# Altium schematic sheet PedalBoard.SchDoc
size D; SheetNumber: 1; SheetTotal: 1; SPICEModelCacheDNIRTYNY: <root> / <DocumentId>DNIRTYNY</DocumentId> / </root>
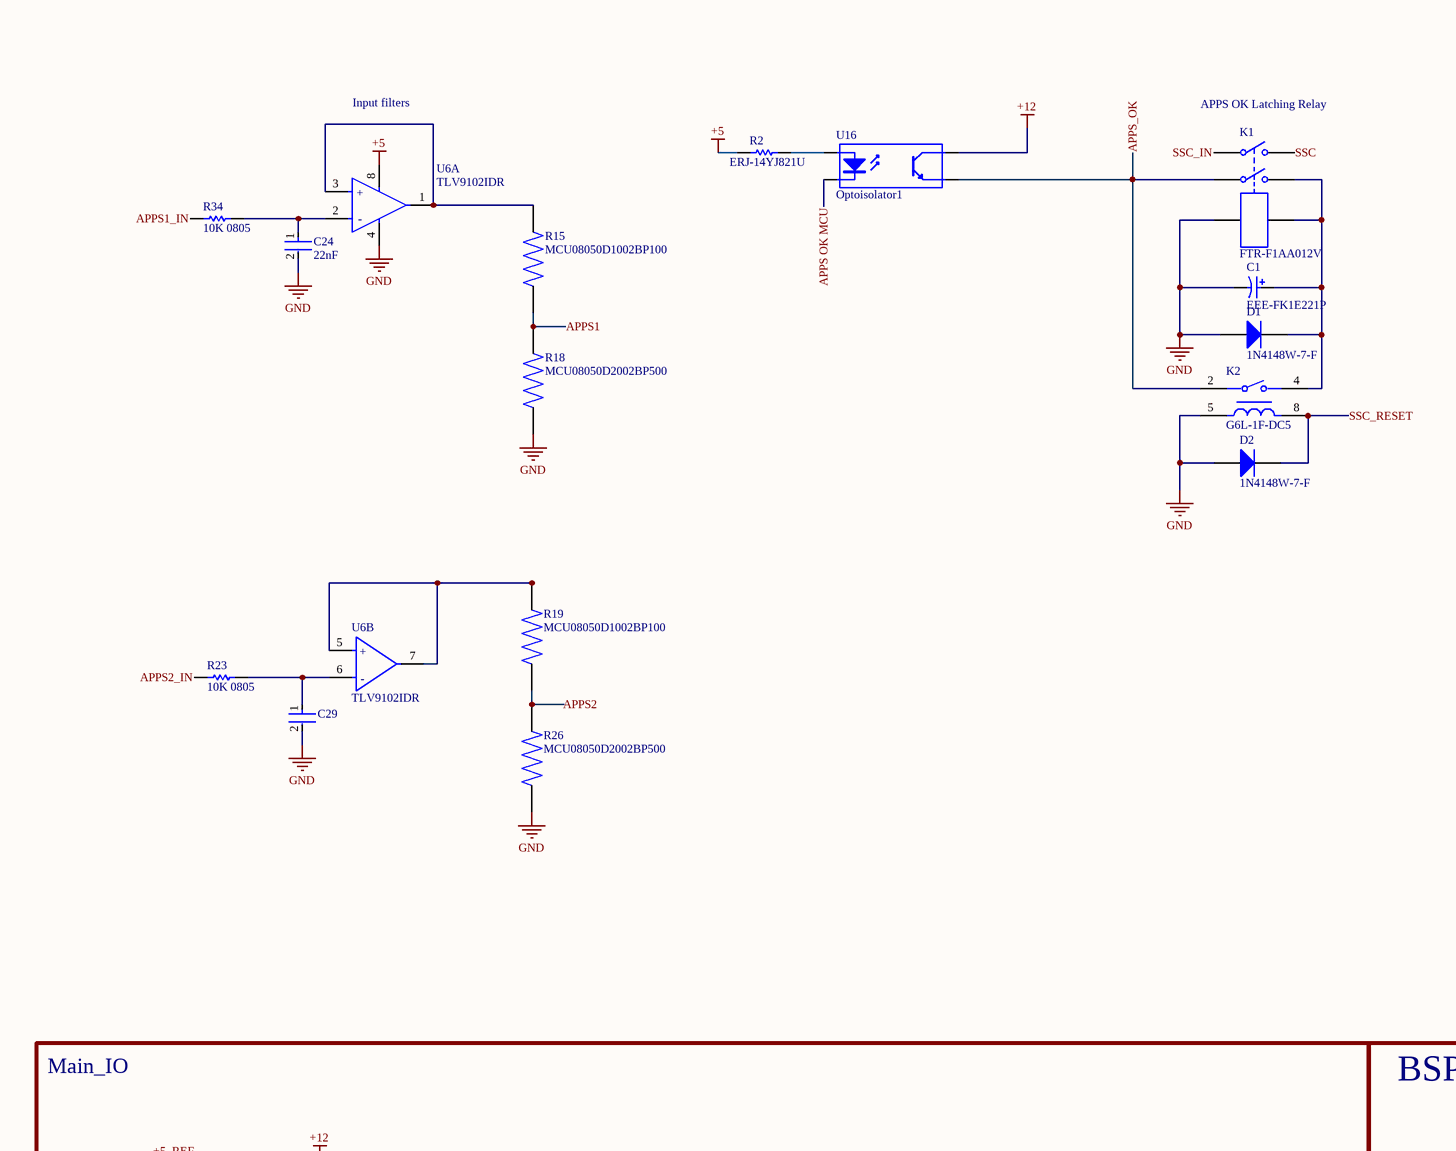
[diagram p0: PedalBoard.SchDoc, top left]
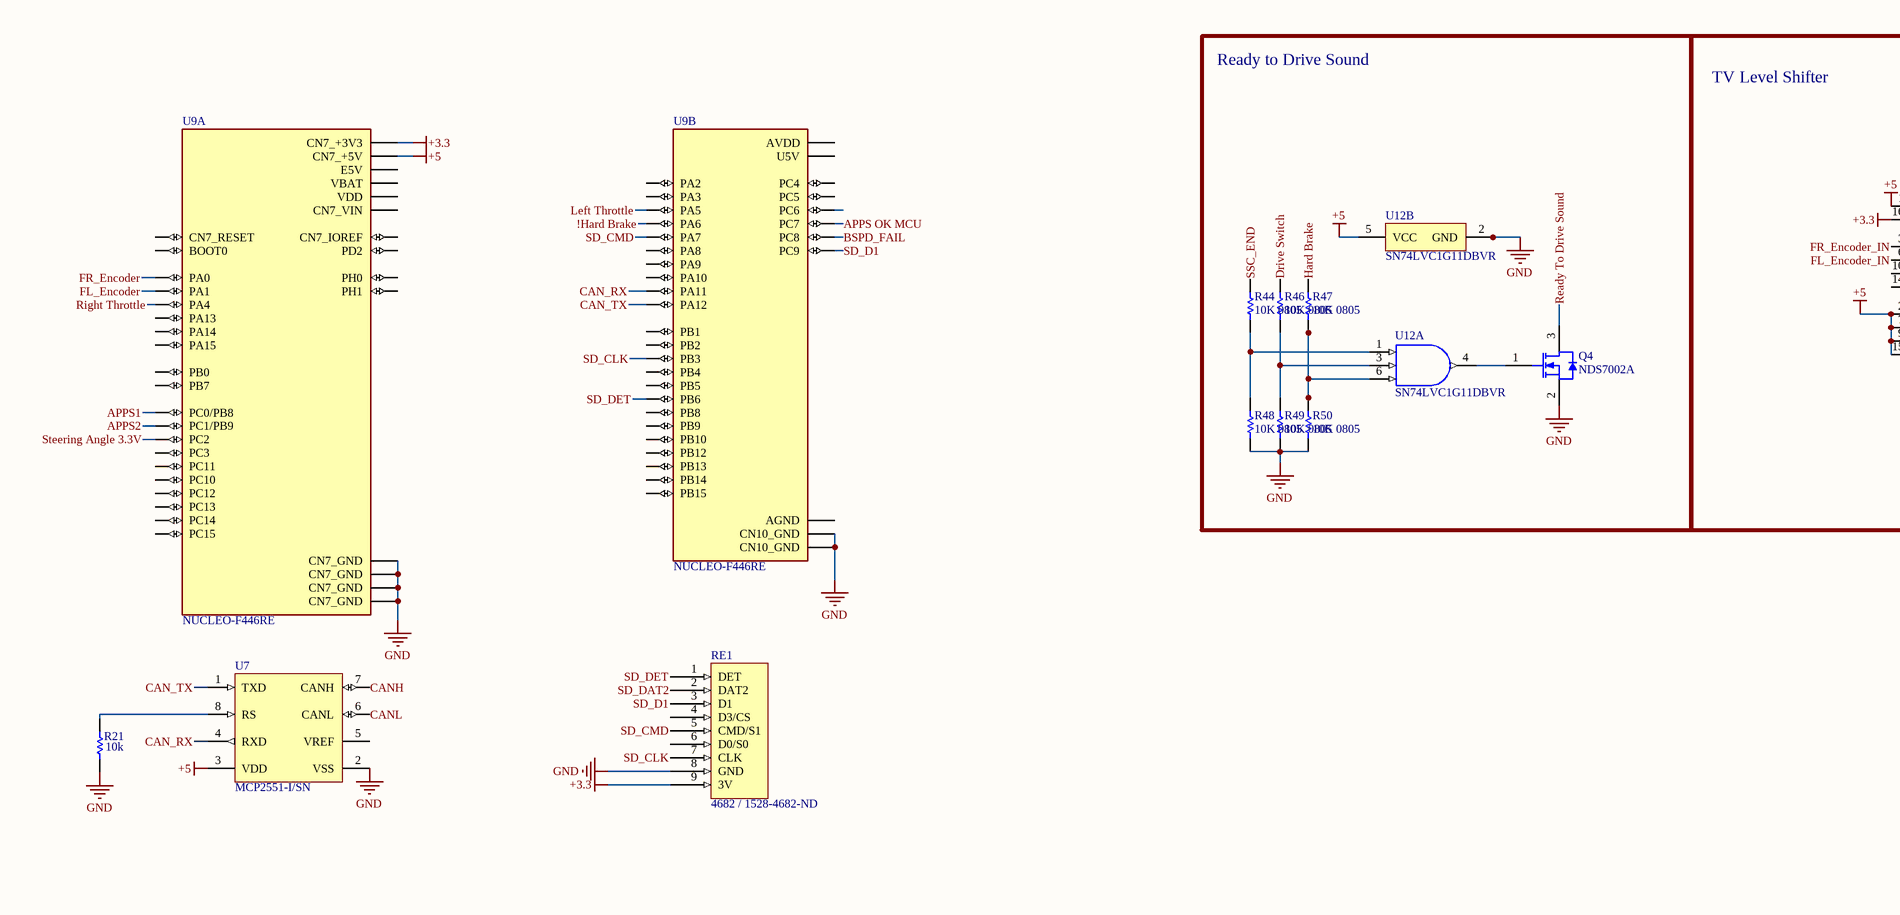
[diagram p1: PedalBoard.SchDoc, top middle]
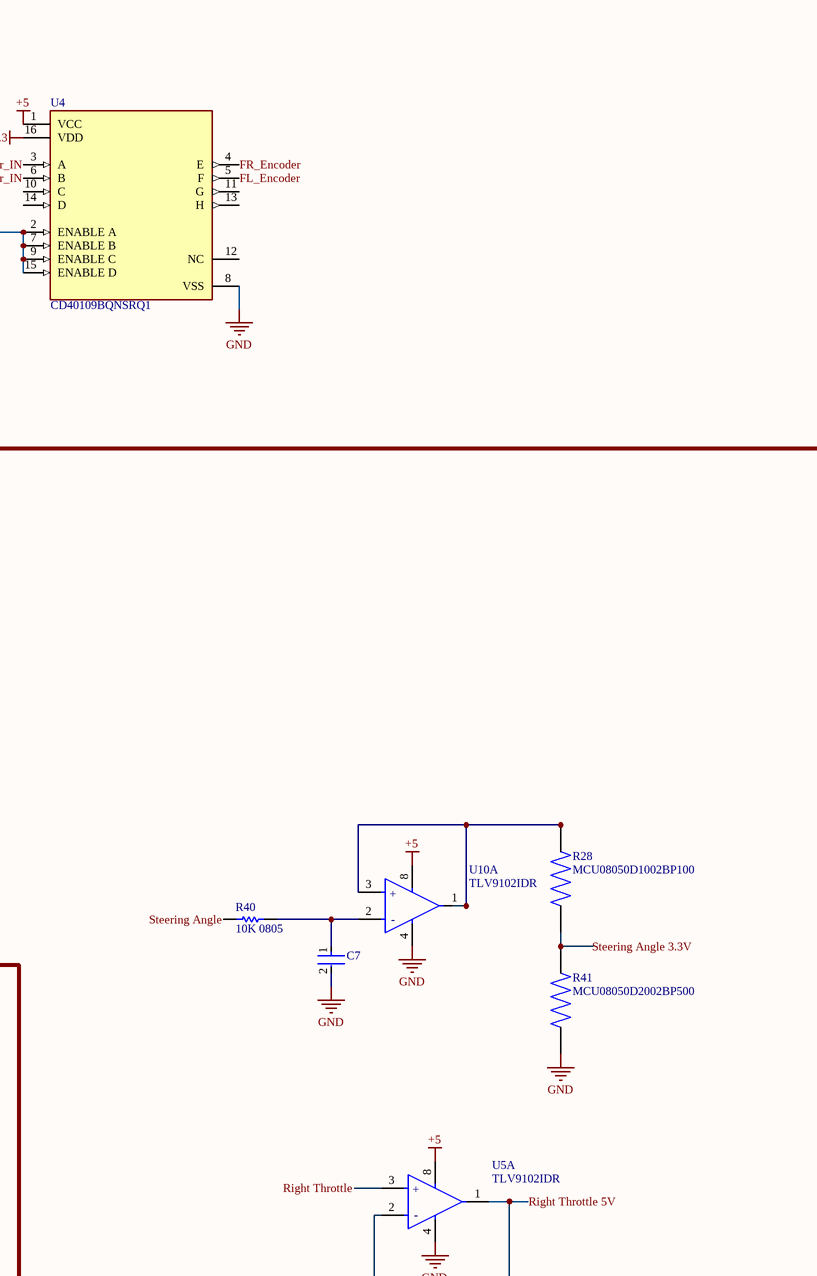
[diagram p2: PedalBoard.SchDoc, top right]
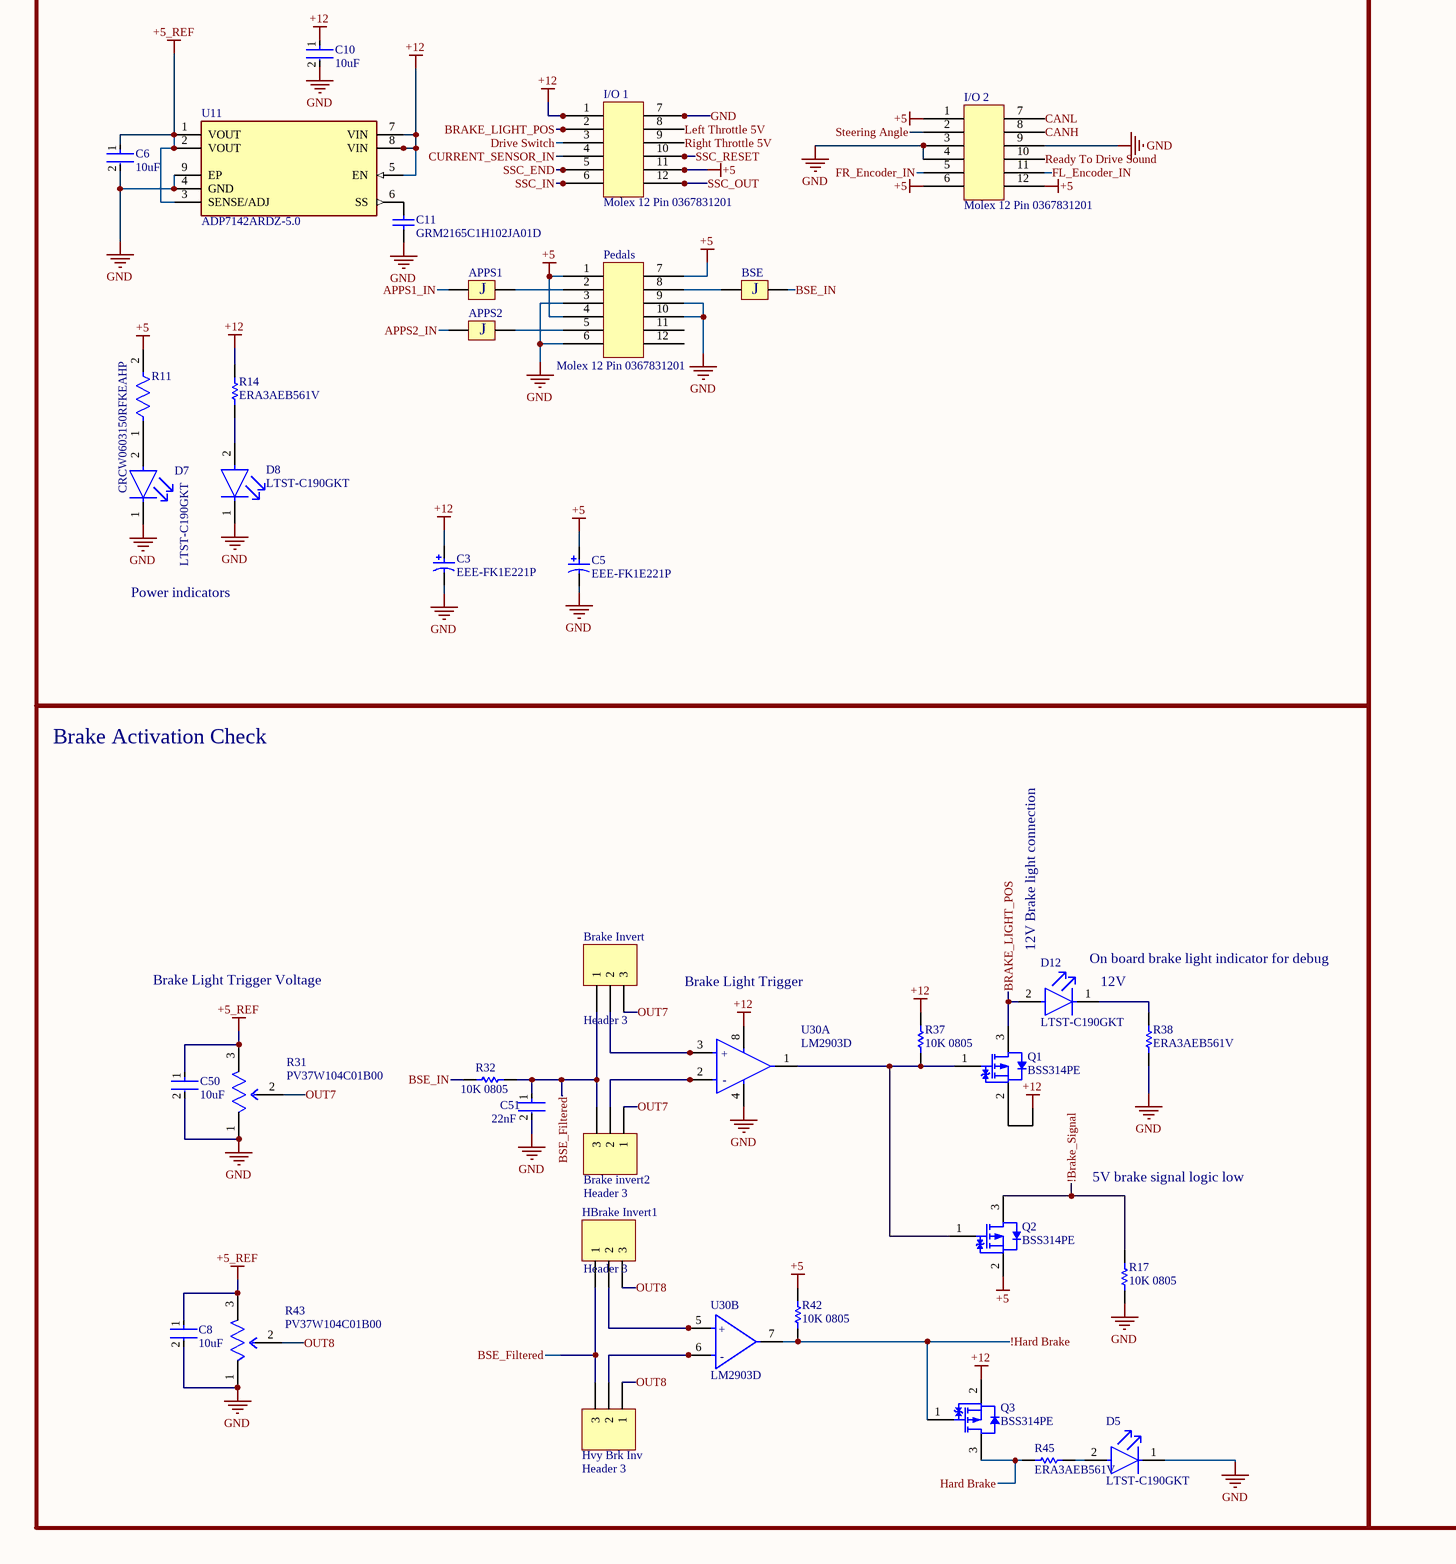
[diagram p3: PedalBoard.SchDoc, bottom left]
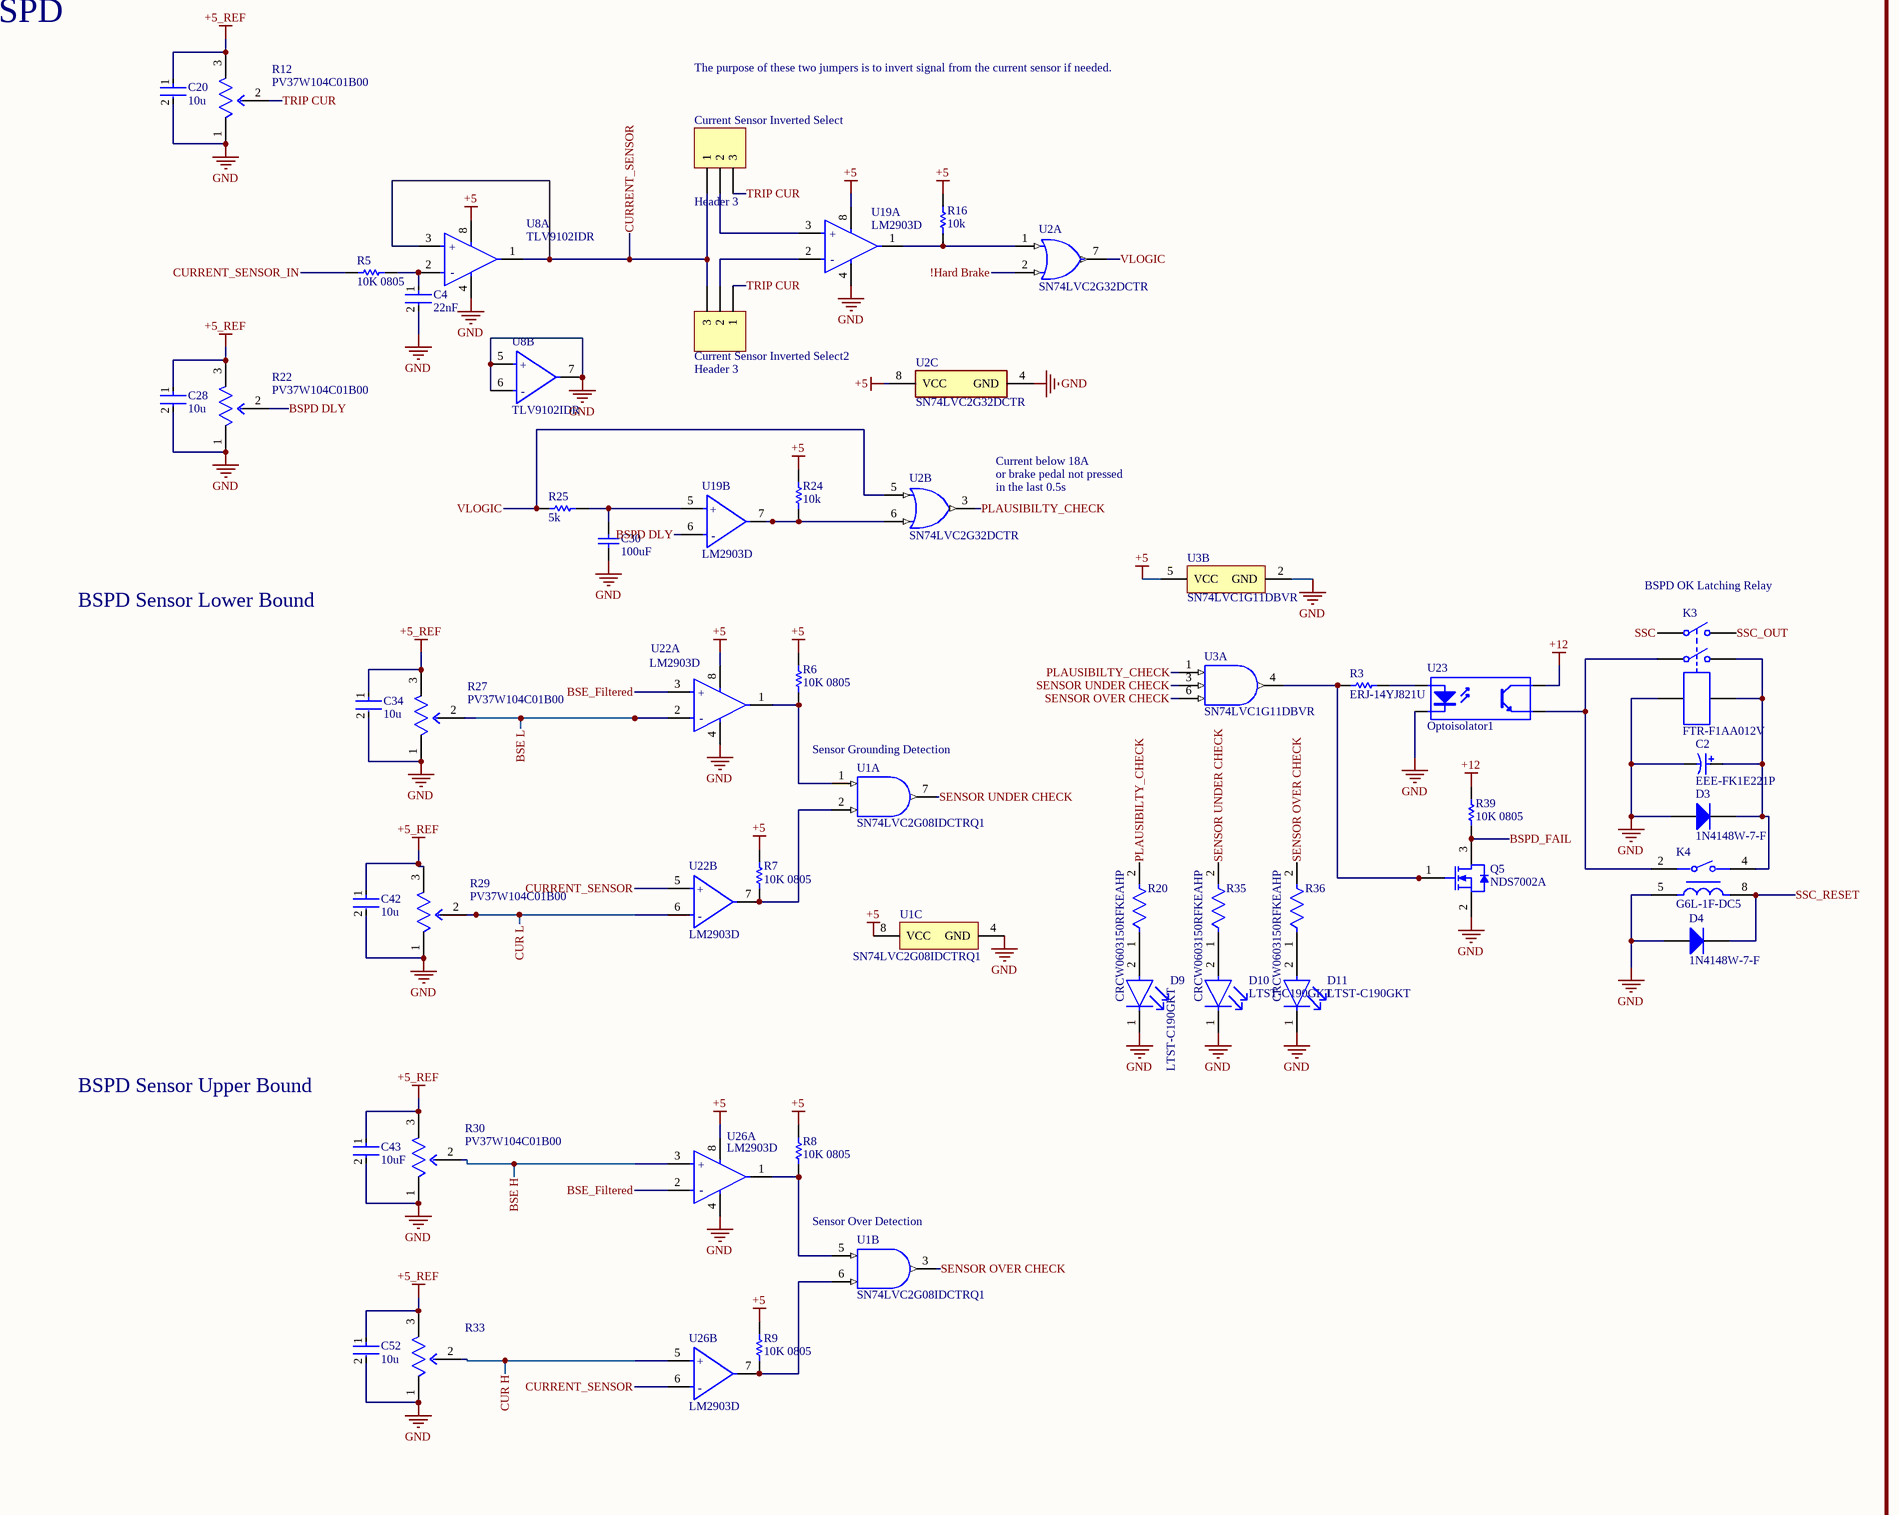
[diagram p4: PedalBoard.SchDoc, bottom middle]
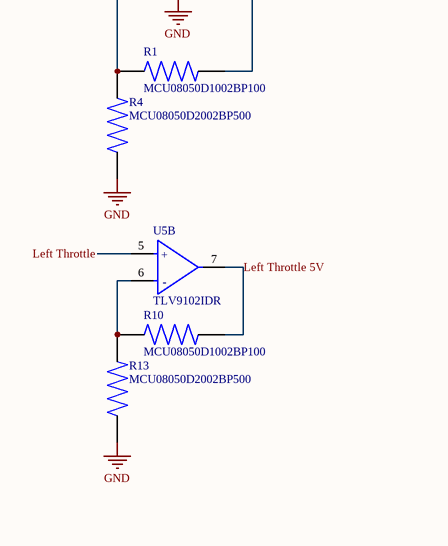
[diagram p5: PedalBoard.SchDoc, bottom right]

## Parts
APPS1  Jumper Connector  [Jumper Connector]  (value not drawn)
APPS2  Jumper Connector  [Jumper Connector]  (value not drawn)
Brake_Invert  Header 3  [HDR1X3]
Brake_invert2  Header 3  [HDR1X3]
BSE  Jumper Connector  [Jumper Connector]  (value not drawn)
C1  EEE-FK1E221P  [PNSC-EEE-FK1E221P_N]
C2  EEE-FK1E221P  [PNSC-EEE-FK1E221P_N]
C3  EEE-FK1E221P  [PNSC-EEE-FK1E221P_N]
C4  22nF  [FP-C0805C-DN-MFG]
C5  EEE-FK1E221P  [PNSC-EEE-FK1E221P_N]
C6  10uF  [FP-C0603C106M9PACTU-MFG]
C7  C0805C223K5RACTU  [FP-C0805C-DN-MFG]  (value not drawn)
C8  10uF  [FP-C0603C106M9PACTU-MFG]
C10  10uF  [FP-C0603C106M9PACTU-MFG]
C11  GRM2165C1H102JA01D  [CAPC2013X70X45NL10T25]
C20  10u  [FP-C0603C106M9PACTU-MFG]
C24  22nF  [FP-C0805C-DN-MFG]
C28  10u  [FP-C0603C106M9PACTU-MFG]
C29  C0805C223K5RACTU  [FP-C0805C-DN-MFG]  (value not drawn)
C30  100uF  [CAPC1608X90X35LL15T15]
C34  10u  [FP-C0603C106M9PACTU-MFG]
C42  10u  [FP-C0603C106M9PACTU-MFG]
C43  10uF  [FP-C0603C106M9PACTU-MFG]
C50  10uF  [FP-C0603C106M9PACTU-MFG]
C51  22nF  [FP-C0805C-DN-MFG]
C52  10u  [FP-C0603C106M9PACTU-MFG]
Current_Sensor_Inverted_Select  Header 3  [HDR1X3]
Current_Sensor_Inverted_Select2  Header 3  [HDR1X3]
D1  1N4148W-7-F  [DIOD-SOD123-2_V]
D2  1N4148W-7-F  [DIOD-SOD123-2_V]
D3  1N4148W-7-F  [DIOD-SOD123-2_V]
D4  1N4148W-7-F  [DIOD-SOD123-2_V]
D5  LTST-C190GKT  [FP-LTST-C190GKT-MFG]
D7  LTST-C190GKT  [FP-LTST-C190GKT-MFG]
D8  LTST-C190GKT  [FP-LTST-C190GKT-MFG]
D9  LTST-C190GKT  [FP-LTST-C190GKT-MFG]
D10  LTST-C190GKT  [FP-LTST-C190GKT-MFG]
D11  LTST-C190GKT  [FP-LTST-C190GKT-MFG]
D12  LTST-C190GKT  [FP-LTST-C190GKT-MFG]
HBrake_Invert1  Header 3  [HDR1X3]
Hvy_Brk_Inv  Header 3  [HDR1X3]
I/O_1  Molex 12 Pin 0367831201  [Molex 12 pos 0367831201 - duplicate]
I/O_2  Molex 12 Pin 0367831201  [Molex 12 pos 0367831201 - duplicate]
K1  FTR-F1AA012V  [FTR-F1AA012V]
K2  G6L-1F-DC5  [FP-G6L-1F-DC5-MFG]
K3  FTR-F1AA012V  [FTR-F1AA012V]
K4  G6L-1F-DC5  [FP-G6L-1F-DC5-MFG]
Pedals  Molex 12 Pin 0367831201  [Molex 12 pos 0367831201 - duplicate]
Q1  BSS314PE  [INF-PG-SOT23_N]
Q2  BSS314PE  [INF-PG-SOT23_N]
Q3  BSS314PE  [INF-PG-SOT23_N]
Q4  NDS7002A  [FAIR-SOT23-3_V]
Q5  NDS7002A  [FAIR-SOT23-3_V]
R1  MCU08050D1002BP100  [RESC2012X55N]
R2  ERJ-14YJ821U  [RESC3225X70X50LL20T20]
R3  ERJ-14YJ821U  [RESC3225X70X50LL20T20]
R4  MCU08050D2002BP500  [RESC2012X55N]
R5  10K 0805  [RESC2013X60X35NL10T20]
R6  10K 0805  [RESC2013X60X35NL10T20]
R7  10K 0805  [RESC2013X60X35NL10T20]
R8  10K 0805  [RESC2013X60X35NL10T20]
R9  10K 0805  [RESC2013X60X35NL10T20]
R10  MCU08050D1002BP100  [RESC2012X55N]
R11  CRCW0603150RFKEAHP  [FP-CRCW0603-HPe3-MFG]
R12  PV37W104C01B00  [FP-PV37W104C01B00-MFG]
R13  MCU08050D2002BP500  [RESC2012X55N]
R14  ERA3AEB561V  [RESC1608X55X30LL20T20]
R15  MCU08050D1002BP100  [RESC2012X55N]
R16  10k  [RESC1609X55X30LL15T15]
R17  10K 0805  [RESC2013X60X35NL10T20]
R18  MCU08050D2002BP500  [RESC2012X55N]
R19  MCU08050D1002BP100  [RESC2012X55N]
R20  CRCW0603150RFKEAHP  [FP-CRCW0603-HPe3-MFG]
R21  10k  [RESC1609X55X30LL15T15]
R22  PV37W104C01B00  [FP-PV37W104C01B00-MFG]
R23  10K 0805  [RESC2013X60X35NL10T20]
R24  10k  [RESC1609X55X30LL15T15]
R25  5k  [RESC1609X55X30LL15T15]
R26  MCU08050D2002BP500  [RESC2012X55N]
R27  PV37W104C01B00  [FP-PV37W104C01B00-MFG]
R28  MCU08050D1002BP100  [RESC2012X55N]
R29  PV37W104C01B00  [FP-PV37W104C01B00-MFG]
R30  PV37W104C01B00  [FP-PV37W104C01B00-MFG]
R31  PV37W104C01B00  [FP-PV37W104C01B00-MFG]
R32  10K 0805  [RESC2013X60X35NL10T20]
R33  PV37W104C01B00  [FP-PV37W104C01B00-MFG]  (value not drawn)
R34  10K 0805  [RESC2013X60X35NL10T20]
R35  CRCW0603150RFKEAHP  [FP-CRCW0603-HPe3-MFG]
R36  CRCW0603150RFKEAHP  [FP-CRCW0603-HPe3-MFG]
R37  10K 0805  [RESC2013X60X35NL10T20]
R38  ERA3AEB561V  [RESC1608X55X30LL20T20]
R39  10K 0805  [RESC2013X60X35NL10T20]
R40  10K 0805  [RESC2013X60X35NL10T20]
R41  MCU08050D2002BP500  [RESC2012X55N]
R42  10K 0805  [RESC2013X60X35NL10T20]
R43  PV37W104C01B00  [FP-PV37W104C01B00-MFG]
R44  10K 0805  [RESC2013X60X35NL10T20]
R45  ERA3AEB561V  [RESC1608X55X30LL20T20]
R46  10K 0805  [RESC2013X60X35NL10T20]
R47  10K 0805  [RESC2013X60X35NL10T20]
R48  10K 0805  [RESC2013X60X35NL10T20]
R49  10K 0805  [RESC2013X60X35NL10T20]
R50  10K 0805  [RESC2013X60X35NL10T20]
RE1  4682 / 1528-4682-ND  [SDCARD]
U1  SN74LVC2G08IDCTRQ1  [DCT0008A_N]  (parts A,B,C of 3)
U2  SN74LVC2G32DCTR  [FP-DCT0008A-MFG]  (parts A,B,C of 3)
U3  SN74LVC1G11DBVR  [DBV0006A_N]  (parts A,B of 2)
U4  CD40109BQNSRQ1  [FP-NS0016A-IPC_C]
U5  TLV9102IDR  [FP-D0008A-IPC_B]  (parts A,B of 2)
U6  TLV9102IDR  [FP-D0008A-IPC_B]  (parts A,B of 2)
U7  MCP2551-I/SN  [MCHP-SN8_V]
U8  TLV9102IDR  [FP-D0008A-IPC_B]  (parts A,B of 2)
U9  NUCLEO-F446RE  [MODULE_NUCLEO-F446RE]  (parts A,B of 6)
U10  TLV9102IDR  [FP-D0008A-IPC_B]  (part A of 2)
U11  ADP7142ARDZ-5.0  [FP-RD-8-1-IPC_B]
U12  SN74LVC1G11DBVR  [DBV0006A_N]  (parts A,B of 2)
U16  Optoisolator1  [FOD852]
U19  LM2903D  [FP-SO8-IPC_C]  (parts A,B of 2)
U22  LM2903D  [FP-SO8-IPC_C]  (parts A,B of 2)
U23  Optoisolator1  [FOD852]
U26  LM2903D  [FP-SO8-IPC_C]  (parts A,B of 2)
U30  LM2903D  [FP-SO8-IPC_C]  (parts A,B of 2)

## Blocks framed on the sheet
Ready to Drive Sound: Q4 R44 R46-R50 U12
TV Level Shifter: U4
Main_IO: APPS1 APPS2 BSE C3 C5 C6 C10 C11 D7 D8 I/O_1 I/O_2 Pedals R11 R14 U11
BSPD: C2 C4 C20 C28 C30 C34 C42 C43 C52 Current_Sensor_Inverted_Select Current_Sensor_Inverted_Select2 D3 D4 D9-D11 K3 K4 Q5 R3 R5-R9 R12 R16 R20 R22 R24 R25 R27 R29 R30 R33 R35 R36 R39 U1-U3 U8 U19 U22 U23 U26
Brake Activation Check: Brake_Invert Brake_invert2 C8 C50 C51 D5 D12 HBrake_Invert1 Hvy_Brk_Inv Q1-Q3 R17 R31 R32 R37 R38 R42 R43 R45 U30

## Nets
+3.3: RE1.9(3V) U4.16(VDD) U9.CN7_16(CN7_+3V3)
+5: C5.1 I/O_1.11 I/O_2.1 I/O_2.6 I/O_2.12 Pedals.1 Pedals.4 Pedals.7 Q2.2(SOURCE) R2.1 R6.2 R7.2 R8.2 R9.2 R11.2 R16.2 R24.2 R42.2 U1.8(VCC) U2.8(VCC) U3.5(VCC) U4.1(VCC) U4.2(ENABLE_A) U4.7(ENABLE_B) U4.9(ENABLE_C) U4.15(ENABLE_D) U5.8(V+) U6.8(V+) U7.3(VDD) U8.8(V+) U9.CN7_18(CN7_+5V) U10.8(V+) U12.5(VCC) U19.8(VCC+) U22.8(VCC+) U26.8(VCC+)
+5_REF: C6.1 C8.1 C20.1 C28.1 C34.1 C42.1 C43.1 C50.1 C52.1 R12.3 R22.3 R27.3 R29.3 R30.3 R31.3 R33.3 R43.3 U11.1(VOUT) U11.2(VOUT) U11.3(SENSE/ADJ)
+12: C3.1 C10.1 I/O_1.1 Q1.2(SOURCE) Q3.2(SOURCE) R14.2 R37.2 R39.1 U11.5(EN) U11.7(VIN) U11.8(VIN) U16.4(C) U23.4(C) U30.8(VCC+)
GND: C1.2 C2.2 C3.2 C4.2 C5.2 C6.2 C7.2 C8.2 C10.2 C11.2 C20.2 C24.2 C28.2 C29.2 C30.1 C34.2 C42.2 C43.2 C50.2 C51.2 C52.2 D1.1(A) D2.1(A) D3.1(A) D4.1(A) D5.1(C) D7.1(C) D8.1(C) D9.1(C) D10.1(C) D11.1(C) I/O_1.7 I/O_2.3 I/O_2.4 I/O_2.9 K1.5 K2.5 K3.5 K4.5 Pedals.3 Pedals.6 Pedals.9 Pedals.10 Q4.2(S) Q5.2(S) R4.1 R12.1 R13.1 R17.1 R18.1 R21.1 R22.1 R26.1 R27.1 R29.1 R30.1 R31.1 R33.1 R38.1 R41.1 R43.1 R48.1 R49.1 R50.1 RE1.8(GND) U1.4(GND) U2.4(GND) U3.2(GND) U4.8(VSS) U5.4(V-) U6.4(V-) U7.2(VSS) U8.4(V-) U8.5(IN2+) U8.6(IN2-) U8.7(OUT2) U9.CN7_8(CN7_GND) U9.CN7_19(CN7_GND) U9.CN7_20(CN7_GND) U9.CN7_22(CN7_GND) U9.CN10_9(CN10_GND) U9.CN10_20(CN10_GND) U10.4(V-) U11.4(GND) U11.9(EP) U12.2(GND) U19.4(VCC-) U22.4(VCC-) U23.2(K) U26.4(VCC-) U30.4(VCC-)
!Brake_Signal: Q2.3(DRAIN) R17.2
!Hard Brake: Q3.1(GATE) R42.1 U2.2(1B) U9.CN10_13(PA6) U30.7(Out2)
APPS1: R15.1 R18.2 U9.CN7_38(PC0/PB8)
APPS1_IN: APPS1.1 R34.1
APPS2: R19.1 R26.2 U9.CN7_36(PC1/PB9)
APPS2_IN: APPS2.1 R23.1
APPS OK MCU: U9.CN10_19(PC7) U16.2(K)
APPS_OK: K1.7 K2.2 U16.3(E)
BRAKE_LIGHT_POS: D12.2(A) I/O_1.2 Q1.3(DRAIN)
BSE H: R30.2 U26.3(In1+)
BSE L: R27.2 U22.2(In1-)
BSE_Filtered: Brake_Invert.1 Brake_invert2.3 C51.1 HBrake_Invert1.1 Hvy_Brk_Inv.3 R32.2 U22.3(In1+) U26.2(In1-)
BSE_IN: BSE.2 R32.1
BSPD DLY: R22.2 U19.6(In2-)
BSPD_FAIL: Q5.3(D) R39.2 U9.CN10_2(PC8)
CAN_RX: U7.4(RXD) U9.CN10_14(PA11)
CAN_TX: U7.1(TXD) U9.CN10_12(PA12)
CANH: I/O_2.8 U7.7(CANH)
CANL: I/O_2.7 U7.6(CANL)
CUR H: R33.2 U26.5(In2+)
CUR L: R29.2 U22.6(In2-)
CURRENT_SENSOR: Current_Sensor_Inverted_Select.1 Current_Sensor_Inverted_Select2.3 U8.1(OUT1) U8.3(IN1+) U22.5(In2+) U26.6(In2-)
CURRENT_SENSOR_IN: I/O_1.4 R5.1
Drive Switch: I/O_1.3 R46.2
FL_Encoder: U4.5(F) U9.CN7_30(PA1)
FL_Encoder_IN: I/O_2.11 U4.6(B)
FR_Encoder: U4.4(E) U9.CN7_28(PA0)
FR_Encoder_IN: I/O_2.5 U4.3(A)
Hard Brake: Q3.3(DRAIN) R45.2 R47.2
Left Throttle: U5.5(IN2+) U9.CN10_11(PA5)
Left Throttle 5V: I/O_1.8 R10.2 U5.7(OUT2)
OUT7: Brake_Invert.3 Brake_invert2.1 R31.2
OUT8: HBrake_Invert1.3 Hvy_Brk_Inv.1 R43.2
PLAUSIBILTY_CHECK: R20.2 U2.3(2Y) U3.1(A)
Ready To Drive Sound: I/O_2.10 Q4.3(D)
Right Throttle: U5.3(IN1+) U9.CN7_32(PA4)
Right Throttle 5V: I/O_1.9 R1.2 U5.1(OUT1)
SD_CLK: RE1.7(CLK) U9.CN10_31(PB3)
SD_CMD: RE1.5(CMD/S1) U9.CN10_15(PA7)
SD_D1: RE1.3(D1) U9.CN10_1(PC9)
SD_DAT2: RE1.2(DAT2)
SD_DET: RE1.1(DET) U9.CN10_17(PB6)
SENSOR OVER CHECK: R36.2 U1.3(2Y) U3.6(C)
SENSOR UNDER CHECK: R35.2 U1.7(1Y) U3.3(B)
SSC: K1.2 K3.1
SSC_END: I/O_1.5 R44.2
SSC_IN: I/O_1.6 K1.1
SSC_OUT: I/O_1.12 K3.2
SSC_RESET: D2.2(K) D4.2(K) I/O_1.10 K2.8 K4.8
Steering Angle: I/O_2.2 R40.1
Steering Angle 3.3V: R28.1 R41.2 U9.CN7_35(PC2)
TRIP CUR: Current_Sensor_Inverted_Select.3 Current_Sensor_Inverted_Select2.1 R12.2
VLOGIC: R25.1 U2.5(2A) U2.7(1Y)
NetAPPS1_2: APPS1.2 Pedals.2
NetAPPS2_2: APPS2.2 Pedals.5
NetBrake_invert2_2: Brake_invert2.2 U30.2(In1-)
NetBrake_Invert_2: Brake_Invert.2 U30.3(In1+)
NetBSE_1: BSE.1 Pedals.8
NetC1_1: C1.1 D1.2(K) K1.4 K1.8 K2.4
NetC2_1: C2.1 D3.2(K) K3.4 K3.8 K4.4
NetC4_1: C4.1 R5.2 U8.2(IN1-)
NetC7_1: C7.1 R40.2 U10.2(IN1-)
NetC11_1: C11.1 U11.6(SS)
NetC24_1: C24.1 R34.2 U6.2(IN1-)
NetC29_1: C29.1 R23.2 U6.6(IN2-)
NetC30_2: C30.2 R25.2 U19.5(In2+)
NetCurrent_Sensor_Inverted_Select2_2: Current_Sensor_Inverted_Select2.2 U19.2(In1-)
NetCurrent_Sensor_Inverted_Select_2: Current_Sensor_Inverted_Select.2 U19.3(In1+)
NetD5_2: D5.2(A) R45.1
NetD7_2: D7.2(A) R11.1
NetD8_2: D8.2(A) R14.1
NetD9_2: D9.2(A) R20.1
NetD10_2: D10.2(A) R35.1
NetD11_2: D11.2(A) R36.1
NetD12_1: D12.1(C) R38.2
NetHBrake_Invert1_2: HBrake_Invert1.2 U30.5(In2+)
NetHvy_Brk_Inv_2: Hvy_Brk_Inv.2 U30.6(In2-)
NetK3_7: K3.7 K4.2 U23.3(E)
NetQ1_1: Q1.1(GATE) Q2.1(GATE) R37.1 U30.1(Out1)
NetQ4_1: Q4.1(G) U12.4(Y)
NetQ5_1: Q5.1(G) R3.1 U3.4(Y)
NetR1_1: R1.1 R4.2 U5.2(IN1-)
NetR2_2: R2.2 U16.1(A)
NetR3_2: R3.2 U23.1(A)
NetR6_1: R6.1 U1.1(1A) U22.1(Out1)
NetR7_1: R7.1 U1.2(1B) U22.7(Out2)
NetR8_1: R8.1 U1.5(2A) U26.1(Out1)
NetR9_1: R9.1 U1.6(2B) U26.7(Out2)
NetR10_1: R10.1 R13.2 U5.6(IN2-)
NetR15_2: R15.2 U6.1(OUT1) U6.3(IN1+)
NetR16_1: R16.1 U2.1(1A) U19.1(Out1)
NetR19_2: R19.2 U6.5(IN2+) U6.7(OUT2)
NetR21_2: R21.2 U7.8(RS)
NetR24_1: R24.1 U2.6(2B) U19.7(Out2)
NetR28_2: R28.2 U10.1(OUT1) U10.3(IN1+)
NetR44_1: R44.1 R48.2 U12.1(A)
NetR46_1: R46.1 R49.2 U12.3(B)
NetR47_1: R47.1 R50.2 U12.6(C)

Not connected (* = marked no-connect by the designer): Pedals 11 12; RE1 4(D3/CS) 6(D0/S0); U4 10(C) 11(G) 12(NC) 13(H) 14(D); U7 5(VREF); U9 CN7_1(PC10) CN7_2(PC11) CN7_3(PC12) CN7_4(PD2) CN7_5(VDD) CN7_6(E5V) CN7_7(BOOT0) CN7_12(CN7_IOREF) CN7_13(PA13) CN7_14(CN7_RESET) CN7_15(PA14) CN7_17(PA15) CN7_21(PB7) CN7_23(PC13) CN7_24(CN7_VIN) CN7_25(PC14) CN7_27(PC15) CN7_29(PH0) CN7_31(PH1) CN7_33(VBAT) CN7_34(PB0) CN7_37(PC3) CN10_3(PB8) CN10_4(PC6) CN10_5(PB9) CN10_6(PC5) CN10_7(AVDD) CN10_8(U5V) CN10_16(PB12) CN10_21(PA9) CN10_22(PB2) CN10_23(PA8) CN10_24(PB1) CN10_25(PB10) CN10_26(PB15) CN10_27(PB4) CN10_28(PB14) CN10_29(PB5) CN10_30(PB13) CN10_32(AGND) CN10_33(PA10) CN10_34(PC4) CN10_35(PA2) CN10_37(PA3)

## Notes on the sheet
- Input filters
- (near K1) APPS OK Latching Relay
- The purpose of these two jumpers is to invert signal from the current sensor if needed.
- Current below 18A
- (near U2) or brake pedal not pressed
- (near U2) in the last 0.5s
- BSPD Sensor Lower Bound
- (near K3) BSPD OK Latching Relay
- Power indicators
- (near U1) Sensor Grounding Detection
- Brake Light Trigger Voltage
- Brake Light Trigger
- (near D12) 12V Brake light connection
- On board brake light indicator for debug
- 12V
- BSPD Sensor Upper Bound
- 5V brake signal logic low
- (near U1) Sensor Over Detection
- (in symbol CMP-04895-000235-1, part A) +; -
- (in symbol CMP-04895-000235-1, part B) +; -
- (in symbol CMP-12132-000005-1, part A) +; -
- (in symbol CMP-12132-000005-1, part B) +; -
- (in symbol Jumper Connector) J

## Library data of the parts
Brake_Invert Brake_invert2 Current_Sensor_Inverted_Select Current_Sensor_Inverted_Select2 HBrake_Invert1 Hvy_Brk_Inv = Header 3: Header, 3-Pin; LatestRevisionDate: 17-Jul-2002; LatestRevisionNote: Re-released for DXP Platform.; Publisher: Altium Limited
C1-C3 C5 = CMP-1665-00017-3: Aluminum Electrolytic Capacitor, 220 uF, +/- 20%, 25 V, -55 to 105 degC, 2-Pin CAPAE, RoHS, Tape and Reel; Manufacturer: Panasonic; Voltage Rating: 25 V; ComponentLink2URL: http://industrial.panasonic.com/cdbs/www-data/pdf/RDE0000/ABA0000C1181.pdf; Height: 10.2 mm; Max Operating Temperature: 105 degC; PackageReference: EEE-FK1E221P; ComponentLink1Description: Manufacturer URL; ComponentLink1URL: http://www.panasonic.com/; Mount: Surface Mount; REACH SVHC: No SVHC; Min Operating Temperature: -55 degC; ComponentLink2Description: Datasheet; DatasheetVersion: 03/2016; Length: 10.2 mm; RoHSCompliant: true; Packaging: Tape and Reel; Package Quantity: 500; Lead Pitch: 3.1 mm; Pins: 2; PackageDescription: 2-Pin Electrolytic Aluminum Capacitor, Body 8.3 x 8.3 mm; Mounting Technology: Surface Mount
C4 C24 C51 = CMP-2007-00338-2: CAP CER 0.022UF 50V X7R 0805; Manufacturer: KEMET; Manufacturer Part Number: C0805C223K5RACTU; Value: 22,000 pF; Material: Ceramic; Tolerance: 0.1; Temperature Coefficient: 30ppm/°C; Automotive: No; Package: C0805C-DN; RoHS: TRUE; Height: 0.88mm; Lead Free: Yes; Temperature Range Low: -55°C; Digikey Description: CAP CER 0.022UF 50V X7R 0805; ComponentLink2Description: Datasheet; Capacitance: 22,000 pF; Mouser Description: Capacitor; Ceramic; Cap; .022uF; Tol 10%; SMT; Vol-Rtg 50V; X7R; Tape and Reel; Device Class L3: Ceramic Capacitors; Category: Cap; Voltage Rating: 50 V; Temperature Characteristic: X7R; Ipc Land Pattern Name: CAPC200125X78; Octopart: https://octopart.com/c0805c223k5ractu-kemet-145968; Device Class L1: Passive Components; Temperature: -55°C to +125°C; ComponentLink2URL: https://content.kemet.com/datasheets/KEM_C1003_C0G_SMD.pdf; Temperature Range High: +125°C; Device Class L2: Capacitors
C6 C8 C10 C20 C28 C34 C42 C43 C50 C52 = CMP-2006-02285-3: CAP CER 10UF 6.3V X5R 0603; Manufacturer Part Number: C0603C106M9PACTU; Manufacturer: Kemet; Material: Ceramic; Temperature Coefficient: 15%; Tolerance: 20%; Category: Cap; Height: 0.9mm; Digikey Description: CAP CER 10UF 6.3V X5R 0603; Mouser Description: In a Pack of 10, KEMET 0603 (1608M) 10µF MLCC 6.3V dc ±20% SMD C0603C106M9PACTU; Voltage Rating: 6.3V; Device Class L2: Capacitors; Temperature Range Low: -55°C; Temperature Characteristic: X5R; ComponentLink2Description: Datasheet; Ipc Land Pattern Name: CAPC16080X80; ComponentLink2URL: http://www.kemet.com/Lists/ProductCatalog/Attachments/19/KEM_C1006_X5R_SMD.pdf; Capacitance: 10uF; Temperature Range High: +85°C; Device Class L3: Ceramic Capacitors; RoHS: TRUE; Automotive: No; Value: 10uF; Temperature: -55°C to +85°C; Device Class L1: Passive Components; Package: C0603C106M9PACTU; Lead Free: Yes; Octopart: https://octopart.com/c0603c106m9pactu-kemet-8375727
C7 C29 = CMP-2007-00338-2: CAP CER 0.022UF 50V X7R 0805; Manufacturer: KEMET; Value: 22,000 pF; Material: Ceramic; Tolerance: 0.1; Temperature Coefficient: 30ppm/°C; Automotive: No; Package: C0805C-DN; RoHS: TRUE; Height: 0.88mm; Lead Free: Yes; Temperature Range Low: -55°C; Digikey Description: CAP CER 0.022UF 50V X7R 0805; ComponentLink2Description: Datasheet; Capacitance: 22,000 pF; Mouser Description: Capacitor; Ceramic; Cap; .022uF; Tol 10%; SMT; Vol-Rtg 50V; X7R; Tape and Reel; Device Class L3: Ceramic Capacitors; Category: Cap; Voltage Rating: 50 V; Temperature Characteristic: X7R; Ipc Land Pattern Name: CAPC200125X78; Manufacturer Part Number: C0805C223K5RACTU; Octopart: https://octopart.com/c0805c223k5ractu-kemet-145968; Device Class L1: Passive Components; Temperature: -55°C to +125°C; ComponentLink2URL: https://content.kemet.com/datasheets/KEM_C1003_C0G_SMD.pdf; Temperature Range High: +125°C; Device Class L2: Capacitors
C11 = CMP-2007-00866-1: Manufacturer: Murata; Part Number: GRM2165C1H102JA01D
C30 = CMP-2006-02216-2: Manufacturer: Kemet; Part Number: C0603C105K3PAC7867
D1-D4 = CMP-2000-04932-2: Fast Switching Diode, 100 V, 0.15 A, -65 to 150 degC, 2-Pin?SOD123, RoHS, Tape and Reel; Recovery Time: 4ns; Brand: DiodesIncorporated; Unit Weight: 0.000353oz; Max Surge Current: 2A; Peak Reverse Voltage: 100V; Ir - Reverse Current: 1uA; Vf - Forward Voltage: 1.25V; Configuration: Single; If - Forward Current: 0.15A; Product Category: Diodes-GeneralPurpose,Power,Switching; Operating Temperature Range: -65Cto+150C; Packaging: Reel; Manufacturer URL: http://www.diodes.com/; Maximum Operating Temperature: +150C; Height: 1.25mm; Minimum Operating Temperature: -65C; Product: SwitchingDiodes; Package URL: http://www.diodes.com/datasheets/ds18004.pdf; Type: SwitchingDiode; Package Reference: SOD123-2; Width: 1.7mm; Datasheet URL: http://www.farnell.com/datasheets/1915529.pdf; Datasheet Version: Rev. 24-2, 10/2013; Series: 1N4148; Factory Pack Quantity: 3000; Length: 2.85mm; RoHS: True; Manufacturer: DiodesIncorporated; Mounting Style: SMD/SMT; Package / Case: SOD-123
D5 D7-D12 = CMP-22017-000005-2: LED GREEN CLEAR CHIP SMD; Dominant Wavelength: 569nm; Reverse Voltage: 5V; Lens Color: Colorless; Viewing Angle: 130°; Voltage: 2V; Forward Current: 30mA; Power Dissipation: 100mW; Luminous Intensity: 6mcd; Number of LEDs: 1; Forward Voltage: 2.1V; Wavelength: 565nm; Test Current: 10mA; Min Operating Temperature: -55°C; Lens Style: Clear; Mount: Surface Mount; Width: 0.8mm; Packaging: Tape and Reel; Lens Transparency: Clear; Case Code (Metric): 1608; Depth: 0.8mm; Case Code (Imperial): 0603; Case/Package: 0603; Number of Pins: 2; Max Operating Temperature: 85°C; Lead Free: Lead Free; Number of Elements: 1; Length: 1.6mm; Height: 0.8mm; Package Quantity: 1; Power Rating: 100mW; Radiation Hardening: No; Illumination Color: Green; Color: Green
K1 K3 = Relay-DPST: Dual-Pole Single-Throw Relay; Published: 24-Mar-1999; LatestRevisionDate: 17-Jul-2002; LatestRevisionNote: Re-released for DXP Platform.; PackageReference: MODULE6; Publisher: Altium Limited
K2 K4 = CMP-08823-000020-1: RELAY TELECOM SPST 1A 5VDC; Manufacturer: Omron; Standoff Height: 0.4mm; Throw Configuration: SPST-NO; Coil Type: Non-Latching; Coil Current: 36mA; Coil Resistance: 139Ω; Number Of Contacts: 1; Coil Voltage: 5V; Coil Power: 180mW; Device Class L3: Signal Relays; Automotive: No; ComponentLink2URL: https://media.digikey.com/pdf/Data%20Sheets/Omron%20PDFs/G6L.pdf; Ambient Temperature Range High: +70°C; Mouser Description: Low Signal Relays - PCB LO PROF SPST 5VDC; RoHS: TRUE; Temperature Range High: +70°C; Height: 4.4mm; Device Class L1: Electromechanical; Lead Free: Yes; Temperature: -40°C to +70°C; Device Class L2: Relays; Manufacturer Part Number: G6L-1F-DC5; Temperature Range Low: -40°C; Category: Relay; Octopart: https://octopart.com/g6l-1f+dc5-omron-18903080; Ambient Temperature Range Low: -40°C; Current Rating: 1A; Package: G6L-1F-DC5; Digikey Description: RELAY TELECOM SPST 1A 5VDC; ComponentLink2Description: Datasheet
Q1-Q3 = CMP-1099-00027-1: P-Channel OptiMOS P3 Small-Signal-Transistor, -30 V VDS, -1.5 A ID, -55 to 150 degC, PG-SOT23, Reel, Green; Manufacturer: Infineon; Rth: 250Â K/W; RDS (on) (max): 140Â mOhm; QG: -2.9Â nC; IDpuls (max): -6.1Â A; RDS (on) (max) (@4.5V): 230Â mOhm; Pto t (max): 0.5Â W; Green: TRUE; VDS (max): -30Â V; VGS(th) (max): -2Â V; VGS(th) (min): -1Â V; ID (max): -1.5Â A; ComponentLink2URL: http://www.infineon.com/dgdl/BSS314PE_rev2.3.pdf?folderId=db3a304314dca38901154a72e3951a65&fileId=db3a304330f68606013109b696aa0084; ComponentLink3Description: Package Specification; ComponentLink1URL: http://www.infineon.com/; ComponentLink1Description: Manufacturer URL; Mounting Technology: Surface Mount; PartNumber: BSS314PE; PackageReference: PG-SOT23; PackageVersion: Apr-08; Halogen-free: TRUE; ComponentLink3URL: http://www.infineon.com/dgdl/SOT23-Package_Overview.pdf?folderId=db3a30431936bc4b0119532290053c66&fileId=db3a30431936bc4b0119533468123c85; PackageDescription: 3-Pin Small Outline Transistor Package, 2.9 x 1.3 mm Body, 0.95 mm Pitch; ComponentLink2Description: Datasheet; DatasheetVersion: Rev. 2.3; Packing: Reel
Q4 Q5 = CMP-2000-06836-1: N-Channel Enhancement Mode Field Effect Transistor, 60 V, 280 mA, -65 to 150 degC, 3-Pin SOT23 (TO-236AB), RoHS, Tape and Reel; Manufacturer: Fairchild Semiconductor; On Resistance Rds(on): 2ohm; Voltage Vgs th Max: 2.5V; Transistor Case Style: SOT-23; Continuous Drain Current Id: 280mA; Full Power Rating Temperature: 25°C; Threshold Voltage Vgs: 2.1V; Package Version: Rev. 12, 03/2016; No. of Pins: 3; External Width: 3.05mm; SMD Marking: 712; Voltage Vgs Rds on Measurement: 10V; Voltage Vds Typ: 60V; External Depth: 2.5mm; Transistor Polarity: NChannel; Pulse Current Idm: 1.5A; Power Dissipation Pd: 300mW; SVHC: NoSVHC(16-Jun-2014); External Length / Height: 1.12mm; No. of Transistors: 1; Packaging: CutTape; Operating Temperature Min: -65°C; Tape Width: 8mm; MSL: MSL1-Unlimited; Device Marking: NDS7002A; Mounting Technology: SurfaceMount; Voltage Vgs Max: 2.1V; Operating Temperature Range: -65°Cto+150°C; Current Id Max: 280mA; Operating Temperature Max: 150°C; Manufacturer URL: https://www.fairchildsemi.com/; Datasheet URL: https://www.fairchildsemi.com/datasheets/ND/NDS7002A.pdf; Rds(on) Test Voltage Vgs: 10V; Drain Source Voltage Vds: 60V; Package Reference: SOT23-3; Current Temperature: 25°C; Package URL: http://www.fairchildsemi.com/dwg/MA/MA03D.pdf; Package Description: 3-Pin Small Outline Transistor, Body 2.92 x 1.325 mm, Pitch 0.95 mm; Datasheet Version: Rev. 2.10, 08/2016
R1 R10 R15 R19 R28 = MCU08050D1002BP100: Res Thin Film 0805 10K Ohm 0.1% 0.125W(1/8W) Â±25ppm/C SMD Automotive Medical T/R; MF: {'manufacturer': u'Vishay'}; MP: MCU08050D1002BP100; Price: None; Package: None; Value: *; Availability: Unavailable
R2 R3 = CMP-2005-03622-1: 820; Manufacturer: Panasonic; Part Number: ERJ-14YJ821U
R4 R13 R18 R26 R41 = MCU08050D2002BP500: RES -FILM RESISTORS-THICK FILM CHIP; MF: {'manufacturer': u'Vishay'}; Package: None; MP: MCU08050D2002BP500; Value: *; Availability: Unavailable; Price: None
R5-R9 R17 R23 R32 R34 R37 R39 R40 R42 R44 R46-R50 = CMP-1659-00013-4: Chip Resistor, 10 KOhm, +/- 1%, 0.125 W, -55 to 155 degC, 0805 (2012 Metric), RoHS, Tape and Reel; Manufacturer: Yageo; Voltage Rating: 150 V; Mount: Surface Mount; ComponentLink1Description: Manufacturer URL; ComponentLink2URL: http://www.yageo.com/documents/recent/PYu-RC_Group_51_RoHS_L_04.pdf; Pins: 2; Length: 2 mm; Min Operating Temperature: -55 degC; Height: 0.5 mm; Mounting Technology: Surface Mount; RoHSCompliant: true; REACH SVHC: No SVHC; ComponentLink1URL: http://www.yageo.com/; Max Operating Temperature: 155 degC; PackageReference: 0805; DatasheetVersion: Rev. 4, 02/2016; Package Quantity: 5000; Packaging: Tape and Reel; ComponentLink2Description: Datasheet; PackageDescription: 2-Pin Surface Mounted Device, Body 2 x 1.25 mm
R11 R20 R35 R36 = CMP-02407-010710-1: RES Thick Film, 150Ω, 1%, 0.33W, 100ppm/°C, 0603; Voltage Rating: 75V; Power Rating: 250mW; Resistance: 150R; Case Code (Metric): 1608; Voltage Rating (DC): 75V; Packaging: Tape and Reel; Composition: Thick Film; Width: 0.033inch; Tolerance: 1%; Military Standard: Not; Max Operating Temperature: 155°C; Contact Plating: Tin; Case/Package: 0603; Features: Automotive AEC-Q200; Depth: 0.85mm; Height: 0.45mm; Package Quantity: 1; Case Code (Imperial): 0603; Temperature Coefficient: 100ppm/°C; Max Power Dissipation: 250mW; Lead Free: Lead Free; Min Operating Temperature: -55°C; Radiation Hardening: No; Mount: Surface Mount; Weight: 7.1E-05oz; Termination: SMD/SMT; Number of Terminations: 2; Length: 1.55mm
R12 R22 R27 R29-R31 R33 R43 = CMP-06028-000005-1: 12-Turn Through Hole Trimmer Resistor with Pin Terminations, 10% 1/4W 150ppm/C; Temperature Coefficient: 150ppm/°C; Number of Turns: 12; Max Power Dissipation: 250mW; Resistance: 100kR; Series: PV37W; Type: Potentiometer; Depth: 4mm; Lead Free: Lead Free; Max Operating Temperature: 125°C; Taper: Linear; Resistor Type: Cermet; Termination: Pin; Length: 6.4mm; Packaging: Bulk; Tolerance: 10%; Power Rating: 250mW; Weight: 340mg; Technology: CERMET; RoHS Compliant: Yes; Mount: Through Hole; Radiation Hardening: No; Package Quantity: 50; Color: Grey; Military Standard: Not; Height: 0.264inch; Min Operating Temperature: -55°C
R14 R38 R45 = CMP-2000-00091-1: Manufacturer: Panasonic; Part Number: ERA3AEB561V
R16 R21 R24 R25 = CMP-1012-00623-3: Chip Resistor, 10 KOhm, +/- 1%, 0.1 W, -55 to 155 degC, 0603 (1608 Metric), RoHS, Tape and Reel; Manufacturer: Panasonic; Voltage Rating: 75V; Case\/Package: 0603; Power Rating: 100mW; Resistance: 10KOhm; Temperature Coefficient: 100ppm\/degreesC; Number of Pins: 2; Package Reference: 603; Depth: 0.8mm; Mount: SurfaceMount; Package Description: 2-Pin Surface Mount Device, Body 1.6 x 0.85 mm; Datasheet Version: 02/2017; Length: 1.6mm; Lead Free: LeadFree; Height: 0.45mm; Number of Terminations: 2; Max Power Dissipation: 100mW; Min Operating Temperature: -55degC; Datasheet URL: https://industrial.panasonic.com/cdbs/www-data/pdf/RDA0000/AOA0000C304.pdf; Termination: SMD/SMT; Case Code (Metric): 1608; Case Code (Imperial): 0603; Tolerance: 1%; Max Operating Temperature: 155degC; RoHSCompliant: true; Voltage Rating (DC): 75V; Radiation Hardening: No; Packaging: TapeandReel; Composition: ThickFilm; Mounting Technology: SurfaceMount; Manufacturer URL: http://www.panasonic.com/; Width: 0.031inch; REACH SVHC: NoSVHC; Contact Plating: Tin; Military Standard: Not; Package Quantity: 1
RE1 = 4682: MICROSD SPI/SPIO BREAKOUT BOARD; Manufacturer: Adafruit Industries; Supplier: Arrow Electronics; Supplier Part Number: 4682; Manufacturer Part Number: 4682; RoHS: No; Stock: 408; Pricing: 1=3.556 (USD)
U1 = CMP-0859-00543-3: Automotive Catalog Dual 2-Input Positive-AND Gate, DCT0008A, LARGE T&R; Manufacturer: Texas Instruments; Generic Part Number: SN74LVC2G08-Q1; F @ Nom Voltage(Max)(Mhz): 150; ICC @ Nom Voltage(Max)(mA): 0.01; Input Type: CMOS/TTL; Output Type: CMOS; Logic: True; VCC(Max)(V): 5.5; Technology Family: LVC; Schmitt Trigger: No; Bits(#): 2; tpd @ Nom Voltage(Max)(ns): 9,5.1,4.7,3.8; VCC(Min)(V): 1.65; Voltage(Nom)(V): 1.8,2.5,3.3,5; Output Drive (IOL/IOH)(Max)(mA): 32/-32; DatasheetVersion: SCES557D; Operating Temperature Range(C): -40 to 85; Rating: Automotive; 3-State Output: No; PackageReference: DCT0008A; Sub-Family: AND Gate
U2 = CMP-0859-00554-4: IC GATE OR 2CH 2-INP SM8; Manufacturer: Texas Instruments; Max Supply Voltage: 5.5V; Logic Function Desc: Non-inverting; Number Of Outputs: 1; Number Of Inputs: 2; Min Supply Voltage: 1.65V; Max Junction Temp: +150°C; Nominal Supply Current: 10uA; Propagation Delay: 3.9ns; Standoff Height: 0mm; Height: 1.3mm; Mouser Description: Logic Gates Dual 2-Input Pos; Temperature Range High: +125°C; Manufacturer Part Number: SN74LVC2G32DCTR; Temperature: -40°C to +125°C; Category: IC; Device Class L3: Logic Gates; Ipc Land Pattern Name: SOP65P400X130-8; Octopart: https://octopart.com/sn74lvc2g32dctr-texas+instruments-464565; RoHS: TRUE; Temperature Range Low: -40°C; Digikey Description: IC GATE OR 2CH 2-INP SM8; Ambient Temperature Range High: +125°C; Device Class L1: Integrated Circuits (ICs); Lead Free: Yes; Automotive: No; Number Of Circuits: 2; ComponentLink2URL: http://www.ti.com/lit/ds/symlink/sn74lvc2g32.pdf; Package: DCT0008A; ComponentLink2Description: Datasheet; Ambient Temperature Range Low: -40°C; Device Class L2: Logic ICs
U3 U12 = CMP-0859-00236-3: Single 3-Input Positive-AND Gate, DBV0006A, LARGE T&R; Manufacturer: Texas Instruments; Output Type: CMOS; Voltage(Nom)(V): 1.8,2.5,3.3,5; ICC @ Nom Voltage(Max)(mA): 0.01; VCC(Min)(V): 1.65; Output Drive (IOL/IOH)(Max)(mA): 32/-32; Schmitt Trigger: No; Input Type: CMOS/TTL; VCC(Max)(V): 5.5; Gate Type: AND; Rating: Catalog; tpd @ Nom Voltage(Max)(ns): 20,7.8,6.2,4.6; Bits(#): 1; F @ Nom Voltage(Max)(Mhz): 150; Logic: True; Technology Family: LVC; Sub-Family: AND Gate; PackageReference: DBV0006A; Operating Temperature Range(C): -40 to 125,-40 to 85; DatasheetVersion: SCES487F; 3-State Output: No; Generic Part Number: SN74LVC1G11
U4 = CMP-04899-000094-1: IC TRNSLTR UNIDIRECTIONAL 16SO; Max Supply Voltage: 18V; Number of Channels: 4; Propagation Delay: 240ns; High Level Output Current: -4mA; Logic Function: Level Shifter; Turn-On Delay Time: 740ns; Data Rate: 10Mbps; Min Supply Voltage: 3V; Low Level Output Current: 4mA; Quiescent Current: 20uA; Output Type: Voltage; Packaging: Tape and Reel; Mount: Surface Mount; Contact Plating: Gold; Min Operating Temperature: -40°C; Number of Circuits: 4; Lead Free: Lead Free; Max Operating Temperature: 125°C; Radiation Hardening: No; Channel Type: Unidirectional; RoHS Compliant: Yes; Series: 4000B; Package Quantity: 2000; Number of Pins: 16; Technology: CMOS; Case/Package: SOP; Number of Bits: 4
U5 U6 U8 U10 = CMP-04895-000235-1: IC OPAMP POWER 2 CIRCUIT 8SOIC
U7 = CMP-0186-00138-3: High-Speed CAN Transceiver, / 1 Mb/s, 4.5 to 5.5 V, 8-Pin SOIC (SN), Industrial Temperature, RoHS, Tube; Manufacturer: Microchip; RoHSCompliant: true; PackageReference: SN8; ComponentLink1URL: http://www.microchip.com/; DatasheetVersion: Rev. F, 07/2010; ComponentLink2Description: Datasheet; ComponentLink2URL: http://ww1.microchip.com/downloads/en/DeviceDoc/21667f.pdf; ComponentLink3Description: Package Specification; PackageDescription: 8-Pin Small Outline Integrated Circuit, Body 4.9 x 3.9 mm, Pitch 1.27 mm; ComponentLink1Description: Manufacturer URL; Mounting Technology: Surface Mount; ComponentLink3URL: http://www.microchip.com/stellent/groups/techpub_sg/documents/packagingspec/en012702.pdf
U9 = NUCLEO-F446RE: STM32 Nucleo-64 development board with STM32F446RET6 MCU, supports Arduino and ST morpho connectivity; MF: {'manufacturer': u'STMicroelectronics'}; MP: NUCLEO-F446RE; Availability: Unavailable; Package: None; Value: *; Price: None
U11 = CMP-09138-000098-1: IC REG LINEAR 5V 200MA 8SOIC; Max Input Voltage: 40V; Number of Regulators: 1; Output Configuration: Positive; Power Supply Rejection Ratio (PSRR): 50dB; Dropout Voltage: 420mV; Quiescent Current: 140uA; Max Supply Current: 320uA; Output Type: Fixed; Min Operating Temperature: -40°C; Number of Pins: 8; Case/Package: SOIC; Output Current: 200mA; Packaging: Rail/Tube; RoHS Compliant: Yes; Mount: Surface Mount; Min Output Voltage: 5V; Lead Free: Contains Lead; Max Operating Temperature: 125°C
U16 U23 = Optoisolator1: 4-Pin Phototransistor Optocoupler; Published: 24-Mar-1999; LatestRevisionDate: 04-Mar-2005; LatestRevisionNote: Sch pins 3 & 4 Swapped.; DatasheetVersion: Nov-2003; PackageReference: DIP-4; Publisher: Altium Limited
U19 U22 U26 U30 = CMP-12132-000005-1: IC COMPARATOR DUAL LP 8-SOIC; Manufacturer: STMicroelectronics; Min Dual Supply Voltage: 1V; Max Supply Voltage: 36V; Nominal Supply Current: 0.4-1mA; Min Supply Voltage: 2V; Number Of Channels: 2; Input Bias Current: 0.025uA; Max Dual Supply Voltage: 18V; Max Junction Temp: +150°C; Input Offset Voltage: 1mV; Output Current Per Channel: 0.001uA; Standoff Height: 0.1mm; Voltage Gain: 200V/mV; Device Class L3: Comparators; Lead Free: Yes; Manufacturer Part Number: LM2903D; Temperature Range High: +125°C; Automotive: No; ComponentLink2URL: https://www.st.com/content/ccc/resource/technical/document/datasheet/44/f7/9d/99/42/20/45/fd/CD00000534.pdf/files/CD00000534.pdf/jcr:content/translations/en.CD00000534.pdf; Height: 1.75mm; Temperature: -40°C to +125°C; RoHS: TRUE; Category: IC; Digikey Description: IC COMPARATOR DUAL LP 8-SOIC; Octopart: https://octopart.com/lm2903d-stmicroelectronics-428759; Package: SO8; Device Class L1: Integrated Circuits (ICs); Mouser Description: Analog Comparators Lo-Pwr Dual Voltage; Temperature Range Low: -40°C; Device Class L2: Linear ICs; ComponentLink2Description: Datasheet